# EAGLE schematic Unbenannt (EAGLE 9.7.0)
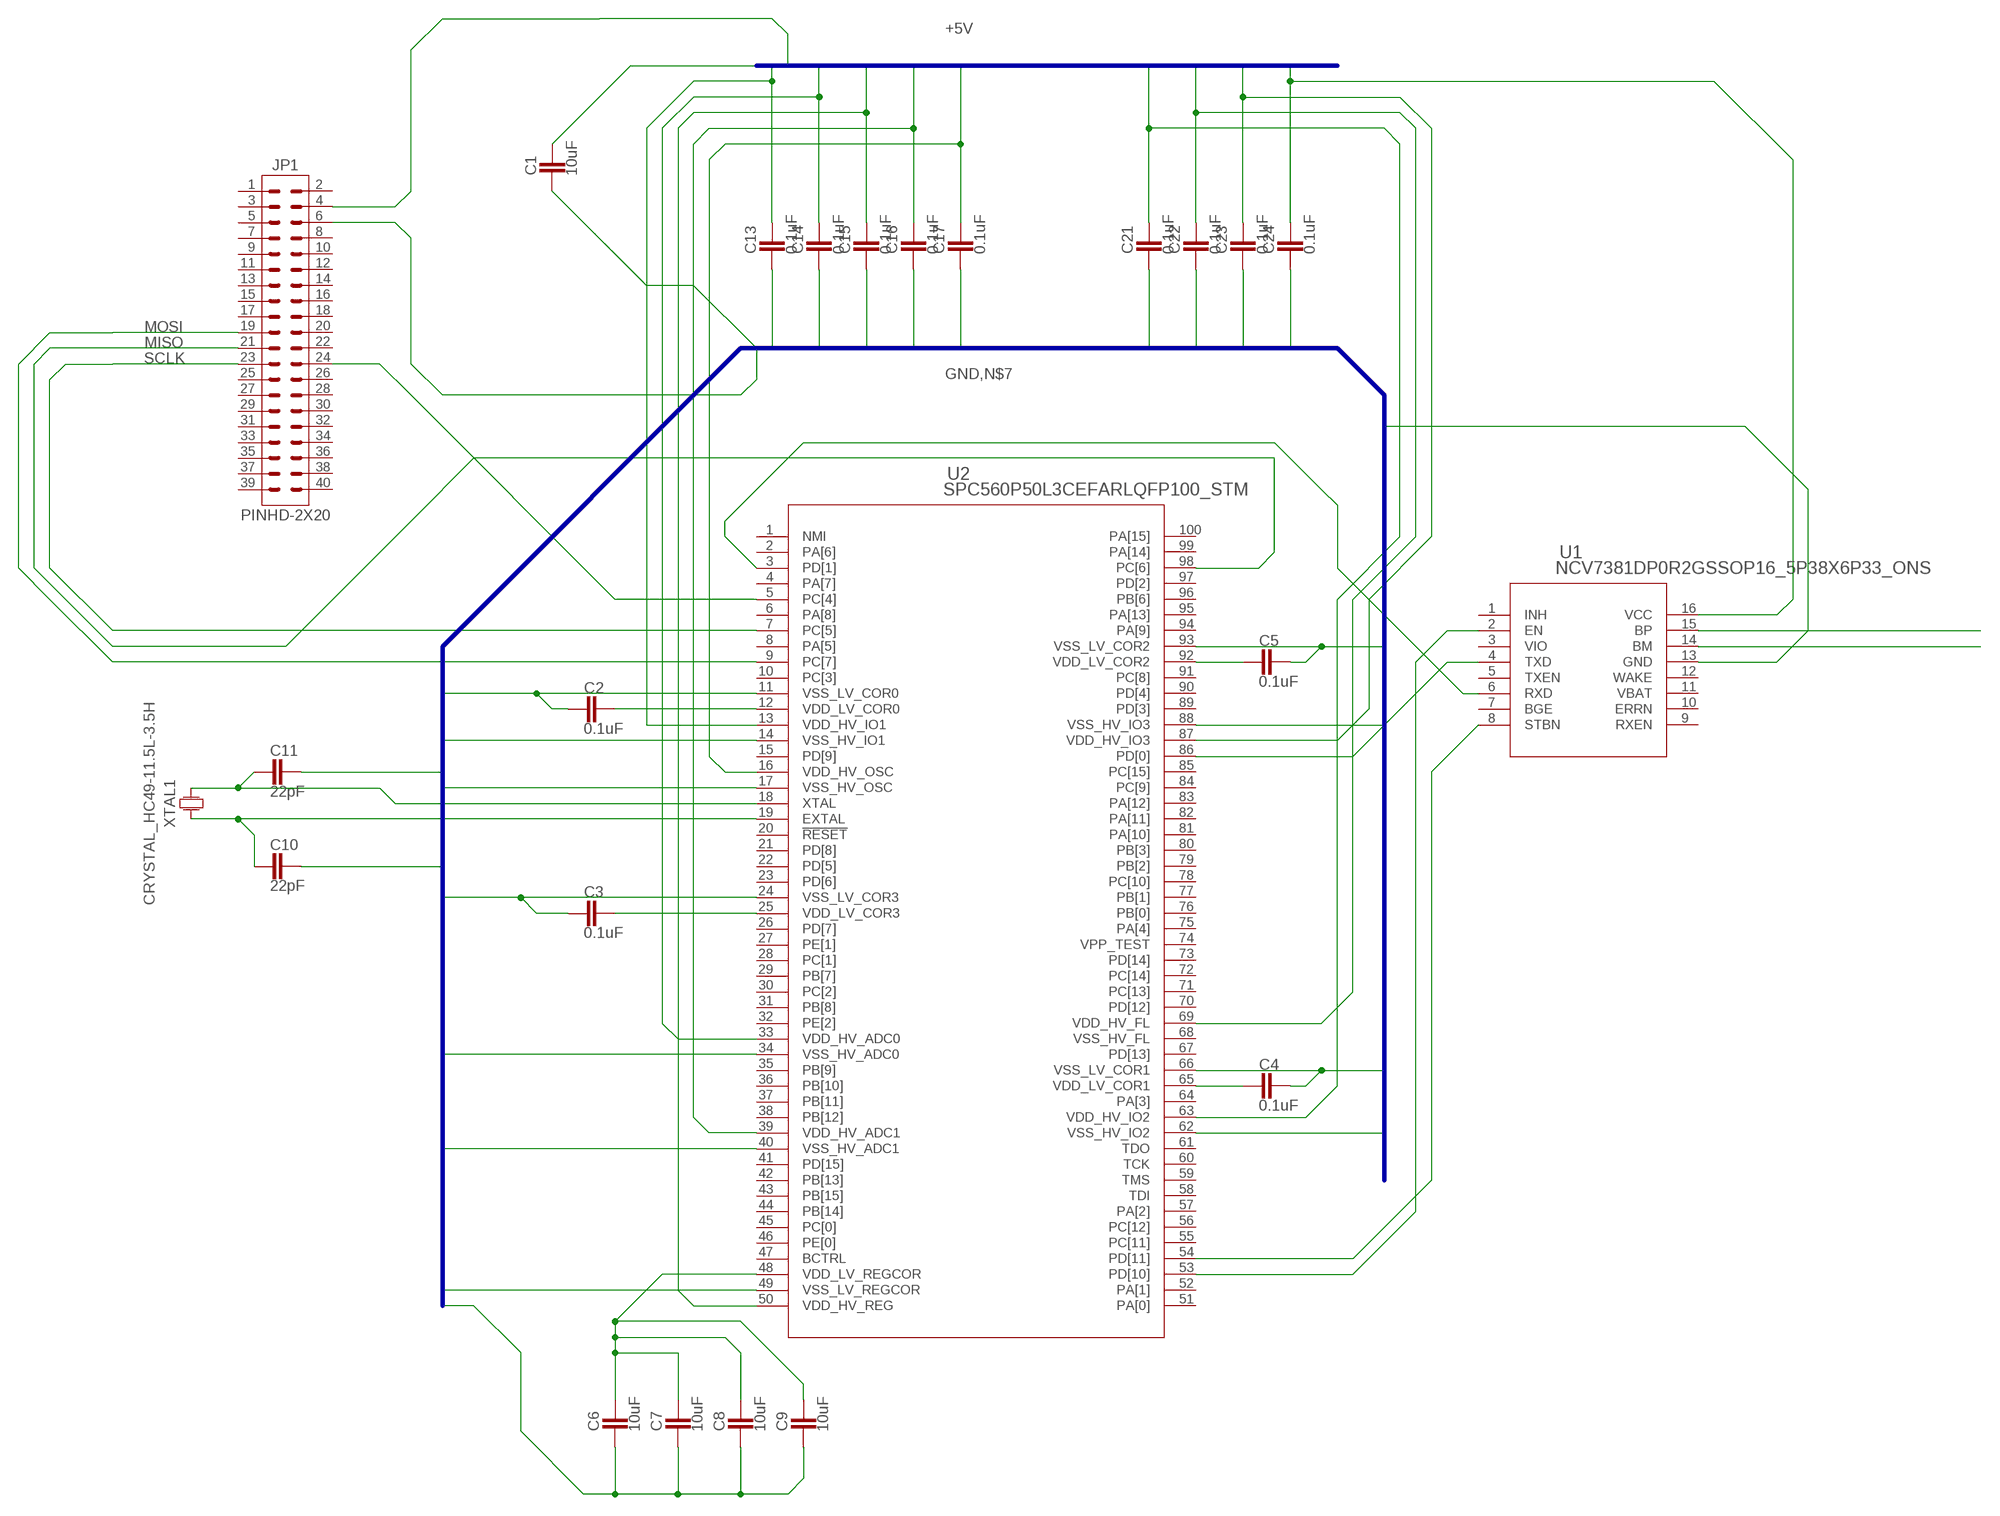
[diagram p0: schematic, sheet 1]

## Parts
C1  10uF  CAPACITOR_CHIP-0402(1005-METRIC)  [CAPC1005X60]
C2  0.1uF  CAPACITOR_CHIP-0402(1005-METRIC)  [CAPC1005X60]
C3  0.1uF  CAPACITOR_CHIP-0402(1005-METRIC)  [CAPC1005X60]
C4  0.1uF  CAPACITOR_CHIP-0402(1005-METRIC)  [CAPC1005X60]
C5  0.1uF  CAPACITOR_CHIP-0402(1005-METRIC)  [CAPC1005X60]
C6  10uF  CAPACITOR_CHIP-0402(1005-METRIC)  [CAPC1005X60]
C7  10uF  CAPACITOR_CHIP-0402(1005-METRIC)  [CAPC1005X60]
C8  10uF  CAPACITOR_CHIP-0402(1005-METRIC)  [CAPC1005X60]
C9  10uF  CAPACITOR_CHIP-0402(1005-METRIC)  [CAPC1005X60]
C10  22pF  CAPACITOR_CHIP-0402(1005-METRIC)  [CAPC1005X60]
C11  22pF  CAPACITOR_CHIP-0402(1005-METRIC)  [CAPC1005X60]
C13  0.1uF  CAPACITOR_CHIP-0402(1005-METRIC)  [CAPC1005X60]
C14  0.1uF  CAPACITOR_CHIP-0402(1005-METRIC)  [CAPC1005X60]
C15  0.1uF  CAPACITOR_CHIP-0402(1005-METRIC)  [CAPC1005X60]
C16  0.1uF  CAPACITOR_CHIP-0402(1005-METRIC)  [CAPC1005X60]
C17  0.1uF  CAPACITOR_CHIP-0402(1005-METRIC)  [CAPC1005X60]
C21  0.1uF  CAPACITOR_CHIP-0402(1005-METRIC)  [CAPC1005X60]
C22  0.1uF  CAPACITOR_CHIP-0402(1005-METRIC)  [CAPC1005X60]
C23  0.1uF  CAPACITOR_CHIP-0402(1005-METRIC)  [CAPC1005X60]
C24  0.1uF  CAPACITOR_CHIP-0402(1005-METRIC)  [CAPC1005X60]
JP1  PINHD-2X20  [2X20]
U1  NCV7381DP0R2GSSOP16_5P38X6P33_ONS  [SSOP16_5P38X6P33_ONS]
U2  SPC560P50L3CEFARLQFP100_STM  [LQFP100_STM]
XTAL1  CRYSTAL_HC49-11.5L-3.5H  [XTALRR488W43L1150T466H350B]

## Nets
+5V: C1.1 C13.1 C14.1 C15.1 C16.1 C17.1 C21.1 C22.1 C23.1 C24.1 JP1.4 U1.16(VCC) U2.13(VDD_HV_IO1) U2.16(VDD_HV_OSC) U2.33(VDD_HV_ADC0) U2.39(VDD_HV_ADC1) U2.50(VDD_HV_REG) U2.63(VDD_HV_IO2) U2.69(VDD_HV_FL) U2.87(VDD_HV_IO3)
GND: C1.2 C2.2 C3.2 C4.1 C5.1 C6.2 C7.2 C8.2 C9.2 C10.1 C11.1 C13.2 C14.2 C15.2 C16.2 C17.2 C21.2 C22.2 C23.2 C24.2 JP1.6 U1.13(GND) U2.11(VSS_LV_COR0) U2.14(VSS_HV_IO1) U2.24(VSS_LV_COR3) U2.34(VSS_HV_ADC0) U2.40(VSS_HV_ADC1) U2.49(VSS_LV_REGCOR) U2.62(VSS_HV_IO2) U2.66(VSS_LV_COR1) U2.88(VSS_HV_IO3) U2.93(VSS_LV_COR2)
MISO: JP1.21 U2.98(PC[6])
MOSI: JP1.19 U2.9(PC[7])
N$1: C2.1 U2.12(VDD_LV_COR0)
N$2: C3.1 U2.25(VDD_LV_COR3)
N$3: C4.2 U2.65(VDD_LV_COR1)
N$4: C5.2 U2.92(VDD_LV_COR2)
N$5: C6.1 C7.1 C8.1 C9.1 U2.48(VDD_LV_REGCOR)
N$6: C10.2 U2.19(EXTAL) XTAL1.1
N$7: U2.17(VSS_HV_OSC)
N$8: C11.2 U2.18(XTAL) XTAL1.2
N$9: JP1.24 U2.5(PC[4])
N$10: U1.4(TXD) U2.86(PD[0])
N$11: U1.6(RXD) U2.3(PD[1])
N$12: U1.2(EN) U2.53(PD[10])
N$13: U1.8(STBN) U2.54(PD[11])
N$14: U1.15(BP)
N$15: U1.14(BM)
SCLK: JP1.23 U2.7(PC[5])
Unconnected: JP1.1 JP1.2 JP1.3 JP1.5 JP1.7 JP1.8 JP1.9 JP1.10 JP1.11 JP1.12 JP1.13 JP1.14 JP1.15 JP1.16 JP1.17 JP1.18 JP1.20 JP1.22 JP1.25 JP1.26 JP1.27 JP1.28 JP1.29 JP1.30 JP1.31 JP1.32 JP1.33 JP1.34 JP1.35 JP1.36 JP1.37 JP1.38 JP1.39 JP1.40 U1.1(INH) U1.5(TXEN) U1.7(BGE) U1.9(RXEN) U1.10(ERRN) U1.12(WAKE) U2.1(NMI) U2.2(PA[6]) U2.4(PA[7]) U2.6(PA[8]) U2.8(PA[5]) U2.10(PC[3]) U2.15(PD[9]) U2.20(!RESET) U2.21(PD[8]) U2.22(PD[5]) U2.23(PD[6]) U2.26(PD[7]) U2.27(PE[1]) U2.28(PC[1]) U2.29(PB[7]) U2.30(PC[2]) U2.31(PB[8]) U2.32(PE[2]) U2.35(PB[9]) U2.36(PB[10]) U2.37(PB[11]) U2.38(PB[12]) U2.41(PD[15]) U2.42(PB[13]) U2.43(PB[15]) U2.44(PB[14]) U2.45(PC[0]) U2.46(PE[0]) U2.47(BCTRL) U2.51(PA[0]) U2.52(PA[1]) U2.55(PC[11]) U2.56(PC[12]) U2.57(PA[2]) U2.58(TDI) U2.59(TMS) U2.60(TCK) U2.61(TDO) U2.64(PA[3]) U2.67(PD[13]) U2.68(VSS_HV_FL) U2.70(PD[12]) U2.71(PC[13]) U2.72(PC[14]) U2.73(PD[14]) U2.75(PA[4]) U2.76(PB[0]) U2.77(PB[1]) U2.78(PC[10]) U2.79(PB[2]) U2.80(PB[3]) U2.81(PA[10]) U2.82(PA[11]) U2.83(PA[12]) U2.84(PC[9]) U2.85(PC[15]) U2.89(PD[3]) U2.90(PD[4]) U2.91(PC[8]) U2.94(PA[9]) U2.95(PA[13]) U2.96(PB[6]) U2.97(PD[2]) U2.99(PA[14]) U2.100(PA[15])

## Buses
+5V
GND,N$7

## Power pins joined to a net without a drawn wire
VBAT: U1.11(VBAT)
VIO: U1.3(VIO)
VPP_TEST: U2.74(VPP_TEST)

## Library data of the parts
C1-C11 C13-C17 C21-C24 = Tinkercad:CAPACITOR: Capacitor - Generic; CATEGORY: Capacitor
JP1 = Connector:PINHD-2X20: Pin Header; CATEGORY: Connectors; DESCRIPTION: Header-Straight-2x20 Position; PACKAGE_TYPE: Through Hole; PITCH: 0.100" (2.54mm); SUBCATEGORY: Headers; TYPE: Male Pins
U1 = 2025-07-09_19-05-42_Library:NCV7381DP0R2G; COPYRIGHT: Copyright (C) 2025 Ultra Librarian. All rights reserved.; MANUFACTURER_NAME: onsemi; MANUFACTURER_PART_NUMBER: NCV7381DP0R2G
U2 = 2025-07-09_19-35-04_Library:SPC560P50L3CEFAR; COPYRIGHT: Copyright (C) 2025 Ultra Librarian. All rights reserved.; DATASHEET: https://www.st.com/resource/en/datasheet/spc560p44l3.pdf; DESCRIPTION: 32-bit Power Architecture MCU for Automotive Chassis and Safety Applications; DIGI-KEY_PART_NUMBER_1: 497-11615-2-ND; DIGI-KEY_PART_NUMBER_2: 497-11615-1-ND; DIGI-KEY_PART_NUMBER_3: 497-11615-6-ND; MANUFACTURER_NAME: STMicroelectronics; MANUFACTURER_PART_NUMBER: SPC560P50L3CEFAR
XTAL1 = Frequency-Source:CRYSTAL: Crystal 2Pin - Generic; CATEGORY: Crystals; PACKAGE_SIZE: HC-49/US; PACKAGE_TYPE: Through Hole